# Altium schematic sheet 1_Apollo connector.schdoc
size 497 x 243 mm; Name: A_A4; Symbol: A_A4; Device: A_A4; @Project Name: TUD-EnergyHarvestingConsole_2022-08-29_17-01-09; REV: 1.0; Date: 2022-07-29; Sheet: 1/1; Draw By: Alejandro Cabrerizo; Convert to PCB: yes; Add into BOM: yes
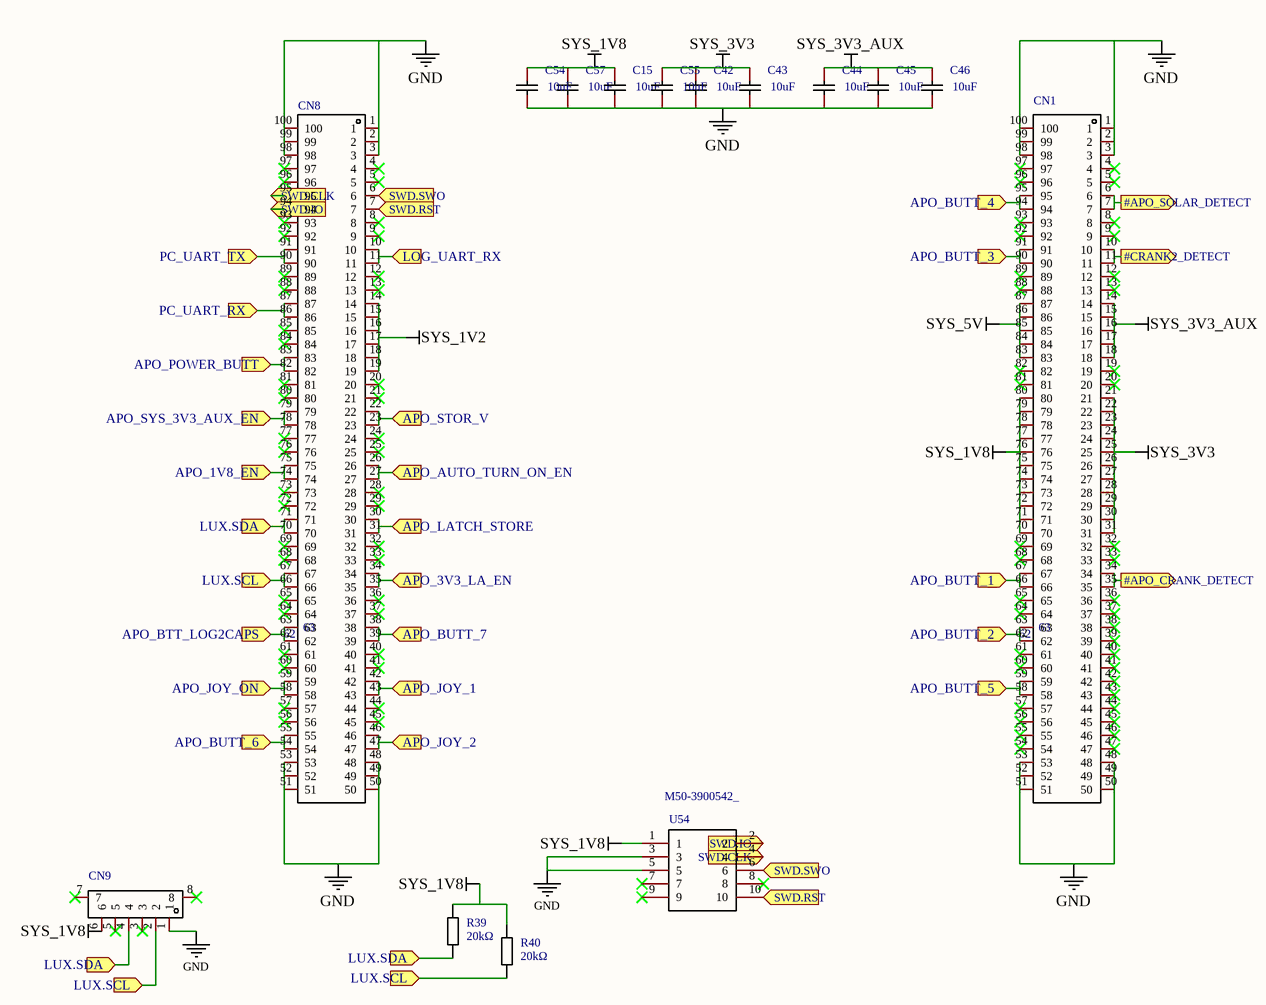
[diagram p0: 1_Apollo connector.schdoc]

## Parts
C15  value 10uF  [C0805]  (hidden comment: CL21A106KAYNNNE)
C42  value 10uF  [C0805]  (hidden comment: CL21A106KAYNNNE)
C43  value 10uF  [C0805]  (hidden comment: CL21A106KAYNNNE)
C44  value 10uF  [C0805]  (hidden comment: CL21A106KAYNNNE)
C45  value 10uF  [C0805]  (hidden comment: CL21A106KAYNNNE)
C46  value 10uF  [C0805]  (hidden comment: CL21A106KAYNNNE)
C54  value 10uF  [C0805]  (hidden comment: CL21A106KAYNNNE)
C55  value 10uF  [C0805]  (hidden comment: CL21A106KAYNNNE)
C57  value 10uF  [C0805]  (hidden comment: CL21A106KAYNNNE)
CN1  NAME: 63  NUMBER: 62  [CONN-SMD_DF40C-100DS-0.4V-51]  (hidden comment: DF40C-100DS-0.4V(51))
CN8  NAME: 63  NUMBER: 62  [CONN-SMD_DF40C-100DS-0.4V-51]  (hidden comment: DF40C-100DS-0.4V(51))
CN9  WAFER-MX1.25-6PWB  [CONN-SMD_6P-P1.25_XUNPU_WAFER-MX1.25-6PWB]  (value not drawn)
R39  20kΩ  [R0603]
R40  20kΩ  [R0603]
U54  M50-3900542_  [HDRRA10W40P127_2X5_635X100X340]

## Ports
#APO_CRANK_DETECT (out), #APO_SOLAR_DETECT (out), #CRANK2_DETECT (out), APO_1V8_EN (in), APO_3V3_LA_EN (in), APO_AUTO_TURN_ON_EN (in), APO_BTT_LOG2CAPS (in), APO_BUTT_1 (in), APO_BUTT_2 (in), APO_BUTT_3 (in), APO_BUTT_4 (in), APO_BUTT_5 (in), APO_BUTT_6 (in), APO_BUTT_7 (in), APO_JOY_1 (in), APO_JOY_2 (in), APO_JOY_ON (in), APO_LATCH_STORE (in), APO_POWER_BUTT (in), APO_STOR_V (in), APO_SYS_3V3_AUX_EN (in), LOG_UART_RX (in), LUX.SCL (in), LUX.SDA (in), PC_UART_RX (in), PC_UART_TX (in), SWD.CLK (in), SWD.IO (in), SWD.RST (in), SWD.SWO (in)

## Nets
GND: C15.1 C42.1 C43.1 C44.1 C45.1 C46.1 C54.1 C55.1 C57.1 CN1.1 CN1.2 CN1.3 CN1.48 CN1.49 CN1.50 CN1.51 CN1.52 CN1.53 CN1.98 CN1.99 CN1.100 CN8.1 CN8.2 CN8.3 CN8.48 CN8.49 CN8.50 CN8.51 CN8.52 CN8.53 CN8.98 CN8.99 CN8.100 CN9.1 U54.3 U54.5
SYS_1V2: CN8.14 CN8.15 CN8.16 CN8.17 CN8.18 CN8.19
SYS_1V8: C15.2 C54.2 C57.2 CN1.70 CN1.71 CN1.72 CN1.73 CN1.74 CN1.75 CN1.76 CN1.77 CN1.78 CN1.79 CN1.80 CN9.6 R39.1 R40.1 U54.1
SYS_3V3: C42.2 C43.2 C55.2 CN1.21 CN1.22 CN1.23 CN1.24 CN1.25 CN1.26 CN1.27 CN1.28 CN1.29 CN1.30 CN1.31
SYS_3V3_AUX: C44.2 C45.2 C46.2 CN1.14 CN1.15 CN1.16 CN1.17 CN1.18
SYS_5V: CN1.83 CN1.84 CN1.85 CN1.86 CN1.87
#APO_CRANK_DETECT: CN1.34 CN1.35 ; port #APO_CRANK_DETECT
#APO_SOLAR_DETECT: CN1.6 CN1.7 ; port #APO_SOLAR_DETECT
#CRANK2_DETECT: CN1.10 CN1.11 ; port #CRANK2_DETECT
APO_1V8_EN: CN8.74 CN8.75 ; port APO_1V8_EN
APO_3V3_LA_EN: CN8.34 CN8.35 ; port APO_3V3_LA_EN
APO_AUTO_TURN_ON_EN: CN8.26 CN8.27 ; port APO_AUTO_TURN_ON_EN
APO_BTT_LOG2CAPS: CN8.62 CN8.63 ; port APO_BTT_LOG2CAPS
APO_BUTT_1: CN1.66 CN1.67 ; port APO_BUTT_1
APO_BUTT_2: CN1.62 CN1.63 ; port APO_BUTT_2
APO_BUTT_3: CN1.90 CN1.91 ; port APO_BUTT_3
APO_BUTT_4: CN1.94 CN1.95 ; port APO_BUTT_4
APO_BUTT_5: CN1.58 CN1.59 ; port APO_BUTT_5
APO_BUTT_6: CN8.54 CN8.55 ; port APO_BUTT_6
APO_BUTT_7: CN8.38 CN8.39 ; port APO_BUTT_7
APO_JOY_1: CN8.42 CN8.43 ; port APO_JOY_1
APO_JOY_2: CN8.46 CN8.47 ; port APO_JOY_2
APO_JOY_ON: CN8.58 CN8.59 ; port APO_JOY_ON
APO_LATCH_STORE: CN8.30 CN8.31 ; port APO_LATCH_STORE
APO_POWER_BUTT: CN8.82 CN8.83 ; port APO_POWER_BUTT
APO_STOR_V: CN8.22 CN8.23 ; port APO_STOR_V
APO_SYS_3V3_AUX_EN: CN8.78 CN8.79 ; port APO_SYS_3V3_AUX_EN
LOG_UART_RX: CN8.10 CN8.11 ; port LOG_UART_RX
LUX.SCL: CN8.66 CN8.67 CN9.2 R40.2 ; port LUX.SCL
LUX.SDA: CN8.70 CN8.71 CN9.4 R39.2 ; port LUX.SDA
PC_UART_RX: CN8.86 CN8.87 ; port PC_UART_RX
PC_UART_TX: CN8.90 CN8.91 ; port PC_UART_TX
SWD.CLK: CN8.95 U54.4 ; port SWD.CLK
SWD.IO: CN8.94 U54.2 ; port SWD.IO
SWD.RST: CN8.7 U54.10 ; port SWD.RST
SWD.SWO: CN8.6 U54.6 ; port SWD.SWO

Not connected (* = marked no-connect by the designer): CN1 4* 5* 8* 9* 12* 13* 19* 20* 32* 33* 36* 37* 38* 39* 40* 41* 42* 43* 44* 45* 46* 47* 54* 55* 56* 57* 60* 61* 64* 65* 68* 69* 81* 82* 88* 89* 92* 93* 96* 97*; CN8 4* 5* 8* 9* 12* 13* 20* 21* 24* 25* 28* 29* 32* 33* 36* 37* 40* 41* 44* 45* 56* 57* 60* 61* 64* 65* 68* 69* 72* 73* 76* 77* 80* 81* 84* 85* 88* 89* 92* 93* 96* 97*; CN9 3* 5* 7* 8*; U54 7* 8* 9*

## Notes on the sheet
- 1
- 2
- 3
- 4
- 5
- A
- B
- C
- D
- TITLE:
- TUD-EnergyHarvestingConsole_2022-08-29_17-01-09
- REV:
- 1.0
- Date:
- Company:
- 2022-07-29
- Drawn By:
- Alejandro Cabrerizo
- Sheet:
- 1/1

## Library data of the parts
C15 C42-C46 C54 C55 C57 = CL21A106KAYNNNE: Capacitance: Tolerance:±10% Tolerance:±10% Voltage Rated: Temperature Coefficient:; Manufacturer: SAMSUNG(三星); Add into BOM: yes; Tolerance: ±10%; Symbol: CL21A106KAYNNNE; Device: CL21A106KAYNNNE; LCSC Part Name: 10uF ±10% 25V; Supplier Part: C15850; Manufacturer Part: CL21A106KAYNNNE; Supplier Footprint: 0805; JLCPCB Part Class: Basic Part; Datasheet: https://atta.szlcsc.com/upload/public/pdf/source/20160103/1457707679302.pdf; Supplier: LCSC; Convert to PCB: yes
CN1 CN8 = DF40C-100DS-0.4V(51): Number of Pins:100 Pitch:0.4mm Number of Rows:2 Gender:Female Mounting Style:Brick nogging Current Rating (Max):300mA Operating Temperature Range:-35℃~+85℃ Operating Temperature Range:-35℃~+85℃; Manufacturer: HRS(广濑); Add into BOM: yes; Pitch: 0.4mm; Gender: Female; Current Rating (Max): 300mA; Name: DF40C-100DS-0.4V(51); Symbol: DF40C-100DS-0.4V(51); Device: DF40C-100DS-0.4V(51); LCSC Part Name: PIN：100 间距0.4mm 母 立贴; Supplier Part: C597931; Manufacturer Part: DF40C-100DS-0.4V(51); Supplier Footprint: SMD,P=0.4mm; JLCPCB Part Class: Extended Part; Datasheet: https://atta.szlcsc.com/upload/public/pdf/source/20200611/C597932_F50447A8BD413549CB06DCD4A9C7496A.pdf; Supplier: LCSC; Convert to PCB: yes; Number of Pins: 100; Number of Rows: 2; Mounting Style: Brick nogging; Operating Temperature Range: -35℃~+85℃
CN9 = WAFER-MX1.25-6PWB: Manufacturer: XUNPU(讯普); Add into BOM: yes; Name: WAFER-MX1.25-6PWB; Symbol: WAFER-MX1.25-6PWB; Device: WAFER-MX1.25-6PWB; LCSC Part Name: MX1.25mm 6P 卧贴; Supplier Part: C3029363; Manufacturer Part: WAFER-MX1.25-6PWB; Supplier Footprint: SMD,P=1.25mm; JLCPCB Part Class: Extended Part; Datasheet: https://atta.szlcsc.com/upload/public/pdf/source/20220527/5ACBB683E384B6AD06743F272F933620.pdf; Supplier: LCSC; Convert to PCB: yes
R39 R40 = 0603WAF2002T5E: Manufacturer: UniOhm; Resistance: 20K; Convert to PCB: yes; NUMBER: 1; Name: 20kΩ; Symbol: 20kΩ; Device: 0603WAF2002T5E; Supplier: LCSC; Manufacturer Part: 0603WAF2002T5E; Supplier Part: C4184; JLCPCB Part Class: Basic Part; Add into BOM: yes; Origin Footprint: R0603
U54 = M50-3900542_: Add into BOM: yes; Symbol: M50-3900542_; Device: M50-3900542_; Convert to PCB: yes